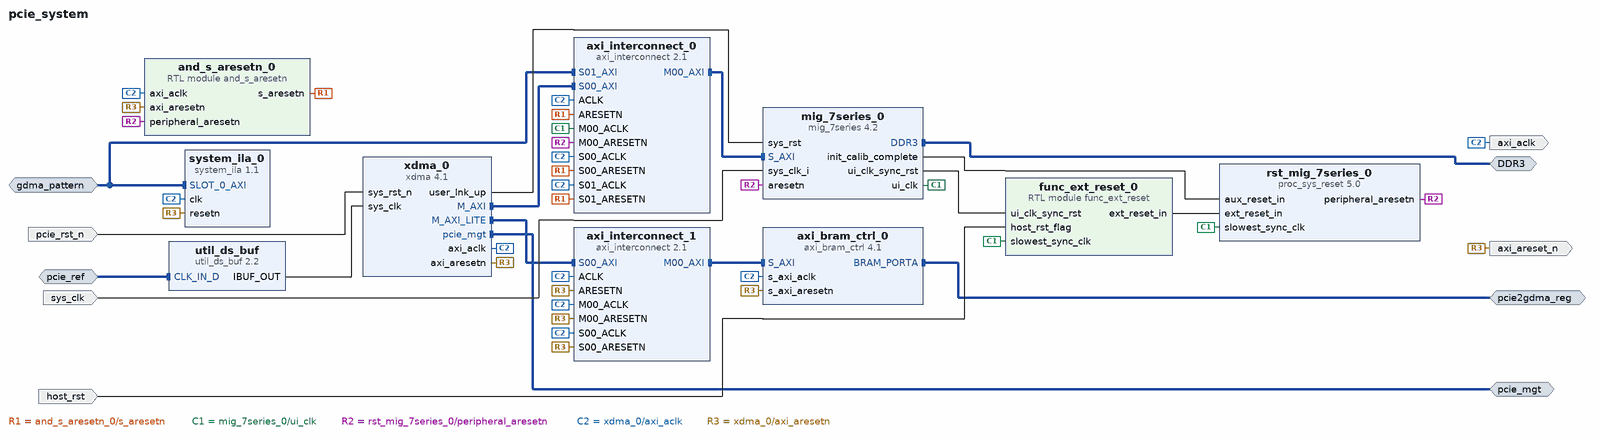
[diagram p0: block diagram of the top level]
# Vivado block design pcie_system, xc7k325tffg900-2, Vivado 2021.1
create_bd_design pcie_system

create_bd_intf_port -mode Master -vlnv xilinx.com:interface:ddrx_rtl:1.0 DDR3
create_bd_intf_port -mode Master -vlnv xilinx.com:interface:pcie_7x_mgt_rtl:1.0 pcie_mgt
create_bd_intf_port -mode Slave -vlnv xilinx.com:interface:diff_clock_rtl:1.0 pcie_ref
set_property -dict {CONFIG.FREQ_HZ 100000000} [get_bd_intf_ports pcie_ref]
create_bd_intf_port -mode Master -vlnv xilinx.com:interface:bram_rtl:1.0 pcie2gdma_reg
set_property -dict {CONFIG.MASTER_TYPE BRAM_CTRL CONFIG.READ_WRITE_MODE READ_WRITE} [get_bd_intf_ports pcie2gdma_reg]
create_bd_intf_port -mode Slave -vlnv xilinx.com:interface:aximm_rtl:1.0 gdma_pattern
set_property -dict [list \
  CONFIG.ADDR_WIDTH 32 \
  CONFIG.ARUSER_WIDTH 0 \
  CONFIG.AWUSER_WIDTH 0 \
  CONFIG.BUSER_WIDTH 0 \
  CONFIG.DATA_WIDTH 32 \
  CONFIG.FREQ_HZ 250000000 \
  CONFIG.HAS_BRESP 1 \
  CONFIG.HAS_BURST 1 \
  CONFIG.HAS_CACHE 1 \
  CONFIG.HAS_LOCK 1 \
  CONFIG.HAS_PROT 1 \
  CONFIG.HAS_QOS 1 \
  CONFIG.HAS_REGION 0 \
  CONFIG.HAS_RRESP 1 \
  CONFIG.HAS_WSTRB 1 \
  CONFIG.ID_WIDTH 1 \
  CONFIG.MAX_BURST_LENGTH 256 \
  CONFIG.NUM_READ_OUTSTANDING 2 \
  CONFIG.NUM_READ_THREADS 1 \
  CONFIG.NUM_WRITE_OUTSTANDING 2 \
  CONFIG.NUM_WRITE_THREADS 1 \
  CONFIG.PROTOCOL AXI4 \
  CONFIG.READ_WRITE_MODE READ_WRITE \
  CONFIG.RUSER_BITS_PER_BYTE 0 \
  CONFIG.RUSER_WIDTH 0 \
  CONFIG.SUPPORTS_NARROW_BURST 1 \
  CONFIG.WUSER_BITS_PER_BYTE 0 \
  CONFIG.WUSER_WIDTH 0 \
] [get_bd_intf_ports gdma_pattern]
create_bd_port -dir O -type clk axi_aclk
set_property -dict {CONFIG.ASSOCIATED_BUSIF gdma_pattern CONFIG.FREQ_HZ 250000000} [get_bd_ports axi_aclk]
create_bd_port -dir I -type rst pcie_rst_n
set_property -dict {CONFIG.POLARITY ACTIVE_LOW} [get_bd_ports pcie_rst_n]
create_bd_port -dir O -type rst axi_areset_n
create_bd_port -dir I -type clk sys_clk
set_property -dict {CONFIG.FREQ_HZ 200000000} [get_bd_ports sys_clk]
create_bd_port -dir I host_rst

create_bd_cell -type ip -vlnv xilinx.com:ip:axi_bram_ctrl:4.1 axi_bram_ctrl_0
set_property -dict {CONFIG.PROTOCOL AXI4LITE CONFIG.READ_LATENCY 2 CONFIG.SINGLE_PORT_BRAM 1} [get_bd_cells axi_bram_ctrl_0]
create_bd_cell -type ip -vlnv xilinx.com:ip:axi_interconnect:2.1 axi_interconnect_0
set_property -dict [list \
  CONFIG.ENABLE_ADVANCED_OPTIONS 0 \
  CONFIG.M00_HAS_DATA_FIFO 1 \
  CONFIG.M00_HAS_REGSLICE 3 \
  CONFIG.NUM_MI 1 \
  CONFIG.NUM_SI 2 \
  CONFIG.S00_HAS_DATA_FIFO 1 \
  CONFIG.S00_HAS_REGSLICE 3 \
  CONFIG.S01_ARB_PRIORITY 1 \
  CONFIG.S01_HAS_DATA_FIFO 1 \
  CONFIG.S01_HAS_REGSLICE 3 \
  CONFIG.S02_HAS_DATA_FIFO 1 \
  CONFIG.S02_HAS_REGSLICE 3 \
  CONFIG.XBAR_DATA_WIDTH 128 \
] [get_bd_cells axi_interconnect_0]
create_bd_cell -type ip -vlnv xilinx.com:ip:axi_interconnect:2.1 axi_interconnect_1
set_property -dict {CONFIG.NUM_MI 1} [get_bd_cells axi_interconnect_1]
create_bd_cell -type ip -vlnv xilinx.com:ip:proc_sys_reset:5.0 rst_mig_7series_0
create_bd_cell -type ip -vlnv xilinx.com:ip:util_ds_buf:2.2 util_ds_buf
set_property -dict {CONFIG.C_BUF_TYPE IBUFDSGTE} [get_bd_cells util_ds_buf]
create_bd_cell -type ip -vlnv xilinx.com:ip:xdma:4.1 xdma_0
set_property -dict [list \
  CONFIG.PF0_DEVICE_ID_mqdma 9028 \
  CONFIG.PF0_SRIOV_VF_DEVICE_ID A038 \
  CONFIG.PF2_DEVICE_ID_mqdma 9228 \
  CONFIG.PF3_DEVICE_ID_mqdma 9328 \
  CONFIG.axi_data_width 128_bit \
  CONFIG.axil_master_64bit_en false \
  CONFIG.axilite_master_en true \
  CONFIG.axist_bypass_en false \
  CONFIG.axisten_freq 250 \
  CONFIG.cfg_mgmt_if false \
  CONFIG.copy_pf0 true \
  CONFIG.coreclk_freq 500 \
  CONFIG.en_pcie_drp false \
  CONFIG.en_transceiver_status_ports false \
  CONFIG.enable_gen4 false \
  CONFIG.enable_lane_reversal false \
  CONFIG.mode_selection Basic \
  CONFIG.pcie_extended_tag true \
  CONFIG.pcie_id_if false \
  CONFIG.pciebar2axibar_axil_master 0x44A00000 \
  CONFIG.pf0_Use_Class_Code_Lookup_Assistant true \
  CONFIG.pf0_base_class_menu Memory_controller \
  CONFIG.pf0_device_id 7028 \
  CONFIG.pf0_interrupt_pin NONE \
  CONFIG.pf0_link_status_slot_clock_config true \
  CONFIG.pf0_msi_cap_multimsgcap 4_vectors \
  CONFIG.pf0_msix_enabled false \
  CONFIG.pf0_sub_class_interface_menu Flash \
  CONFIG.pf1_bar0_scale Kilobytes \
  CONFIG.pf1_bar0_size 128 \
  CONFIG.pf1_bar1_enabled false \
  CONFIG.pf1_msix_cap_table_size 020 \
  CONFIG.pipe_sim false \
  CONFIG.pl_link_cap_max_link_speed 5.0_GT/s \
  CONFIG.pl_link_cap_max_link_width X8 \
  CONFIG.plltype QPLL1 \
  CONFIG.ref_clk_freq 100_MHz \
  CONFIG.xdma_axi_intf_mm AXI_Memory_Mapped \
  CONFIG.xdma_num_usr_irq 1 \
  CONFIG.xdma_pcie_64bit_en false \
  CONFIG.xdma_rnum_chnl 2 \
  CONFIG.xdma_sts_ports false \
  CONFIG.xdma_wnum_chnl 2 \
] [get_bd_cells xdma_0]
create_bd_cell -type ip -vlnv xilinx.com:ip:mig_7series:4.2 mig_7series_0
set_property -dict [list \
  CONFIG.BOARD_MIG_PARAM Custom \
  CONFIG.RESET_BOARD_INTERFACE Custom \
  CONFIG.XML_INPUT_FILE mig_b.prj \
] [get_bd_cells mig_7series_0]
create_bd_cell -type module -reference and_s_aresetn and_s_aresetn_0
create_bd_cell -type module -reference func_ext_reset func_ext_reset_0
create_bd_cell -type ip -vlnv xilinx.com:ip:system_ila:1.1 system_ila_0
set_property -dict [list \
  CONFIG.C_MON_TYPE INTERFACE \
  CONFIG.C_NUM_MONITOR_SLOTS 1 \
  CONFIG.C_SLOT_0_APC_EN 0 \
  CONFIG.C_SLOT_0_AXI_AR_SEL_DATA 1 \
  CONFIG.C_SLOT_0_AXI_AR_SEL_TRIG 1 \
  CONFIG.C_SLOT_0_AXI_AW_SEL_DATA 1 \
  CONFIG.C_SLOT_0_AXI_AW_SEL_TRIG 1 \
  CONFIG.C_SLOT_0_AXI_B_SEL_DATA 1 \
  CONFIG.C_SLOT_0_AXI_B_SEL_TRIG 1 \
  CONFIG.C_SLOT_0_AXI_R_SEL_DATA 1 \
  CONFIG.C_SLOT_0_AXI_R_SEL_TRIG 1 \
  CONFIG.C_SLOT_0_AXI_W_SEL_DATA 1 \
  CONFIG.C_SLOT_0_AXI_W_SEL_TRIG 1 \
  CONFIG.C_SLOT_0_INTF_TYPE xilinx.com:interface:aximm_rtl:1.0 \
] [get_bd_cells system_ila_0]

# ---- connections ----

connect_bd_intf_net -intf_net S01_AXI_0_1 [get_bd_intf_ports gdma_pattern] [get_bd_intf_pins axi_interconnect_0/S01_AXI]
connect_bd_intf_net [get_bd_intf_ports gdma_pattern] [get_bd_intf_pins system_ila_0/SLOT_0_AXI]
connect_bd_intf_net [get_bd_intf_ports pcie2gdma_reg] [get_bd_intf_pins axi_bram_ctrl_0/BRAM_PORTA]
connect_bd_intf_net [get_bd_intf_pins axi_interconnect_0/M00_AXI] [get_bd_intf_pins mig_7series_0/S_AXI]
connect_bd_intf_net [get_bd_intf_pins axi_bram_ctrl_0/S_AXI] [get_bd_intf_pins axi_interconnect_1/M00_AXI]
connect_bd_intf_net -intf_net diff_clock_rtl_0_1 [get_bd_intf_ports pcie_ref] [get_bd_intf_pins util_ds_buf/CLK_IN_D]
connect_bd_intf_net [get_bd_intf_ports DDR3] [get_bd_intf_pins mig_7series_0/DDR3]
connect_bd_intf_net [get_bd_intf_pins axi_interconnect_0/S00_AXI] [get_bd_intf_pins xdma_0/M_AXI]
connect_bd_intf_net [get_bd_intf_pins xdma_0/M_AXI_LITE] [get_bd_intf_pins axi_interconnect_1/S00_AXI]
connect_bd_intf_net [get_bd_intf_ports pcie_mgt] [get_bd_intf_pins xdma_0/pcie_mgt]
connect_bd_net [get_bd_pins and_s_aresetn_0/s_aresetn] \
  [get_bd_pins axi_interconnect_0/ARESETN] [get_bd_pins axi_interconnect_0/S00_ARESETN] \
  [get_bd_pins axi_interconnect_0/S01_ARESETN]
connect_bd_net [get_bd_pins func_ext_reset_0/ext_reset_in] [get_bd_pins rst_mig_7series_0/ext_reset_in]
connect_bd_net [get_bd_ports host_rst] [get_bd_pins func_ext_reset_0/host_rst_flag]
connect_bd_net [get_bd_pins mig_7series_0/init_calib_complete] [get_bd_pins rst_mig_7series_0/aux_reset_in]
connect_bd_net [get_bd_pins mig_7series_0/ui_clk] \
  [get_bd_pins axi_interconnect_0/M00_ACLK] [get_bd_pins rst_mig_7series_0/slowest_sync_clk] \
  [get_bd_pins func_ext_reset_0/slowest_sync_clk]
connect_bd_net [get_bd_pins mig_7series_0/ui_clk_sync_rst] [get_bd_pins func_ext_reset_0/ui_clk_sync_rst]
connect_bd_net -net reset_rtl_0_1 [get_bd_ports pcie_rst_n] [get_bd_pins xdma_0/sys_rst_n]
connect_bd_net -net rst_mig_7series_0_100M_peripheral_aresetn [get_bd_pins rst_mig_7series_0/peripheral_aresetn] \
  [get_bd_pins axi_interconnect_0/M00_ARESETN] [get_bd_pins mig_7series_0/aresetn] \
  [get_bd_pins and_s_aresetn_0/peripheral_aresetn]
connect_bd_net -net sys_clk_i_0_1 [get_bd_ports sys_clk] [get_bd_pins mig_7series_0/sys_clk_i]
connect_bd_net [get_bd_pins util_ds_buf/IBUF_OUT] [get_bd_pins xdma_0/sys_clk]
connect_bd_net [get_bd_pins xdma_0/axi_aclk] \
  [get_bd_ports axi_aclk] [get_bd_pins axi_bram_ctrl_0/s_axi_aclk] [get_bd_pins axi_interconnect_0/ACLK] \
  [get_bd_pins axi_interconnect_0/S00_ACLK] [get_bd_pins axi_interconnect_1/ACLK] [get_bd_pins axi_interconnect_1/S00_ACLK] \
  [get_bd_pins axi_interconnect_1/M00_ACLK] [get_bd_pins axi_interconnect_0/S01_ACLK] [get_bd_pins and_s_aresetn_0/axi_aclk] \
  [get_bd_pins system_ila_0/clk]
connect_bd_net [get_bd_pins xdma_0/axi_aresetn] \
  [get_bd_ports axi_areset_n] [get_bd_pins axi_bram_ctrl_0/s_axi_aresetn] [get_bd_pins axi_interconnect_1/ARESETN] \
  [get_bd_pins axi_interconnect_1/S00_ARESETN] [get_bd_pins axi_interconnect_1/M00_ARESETN] \
  [get_bd_pins and_s_aresetn_0/axi_aresetn] [get_bd_pins system_ila_0/resetn]
connect_bd_net [get_bd_pins xdma_0/user_lnk_up] [get_bd_pins mig_7series_0/sys_rst]
set_property HDL_ATTRIBUTE.DEBUG true [get_bd_intf_nets S01_AXI_0_1]
set_property HDL_ATTRIBUTE.MARK_DEBUG true [get_bd_intf_nets S01_AXI_0_1]

# ---- address map ----
assign_bd_address -offset 0x00000000 -range 2G -target_address_space [get_bd_addr_spaces gdma_pattern] [get_bd_addr_segs mig_7series_0/memmap/memaddr]
assign_bd_address -offset 0x0000000000000000 -range 2G -target_address_space [get_bd_addr_spaces xdma_0/M_AXI] [get_bd_addr_segs mig_7series_0/memmap/memaddr]
assign_bd_address -offset 0x44A10000 -range 4K -target_address_space [get_bd_addr_spaces xdma_0/M_AXI_LITE] [get_bd_addr_segs axi_bram_ctrl_0/S_AXI/Mem0]

validate_bd_design
save_bd_design
